# Altium schematic sheet [06]-xxx.SchDoc: XXX
size A3; Organization: Toradex AG; Address1: Altsagenstrasse 5; Address2: Horw; Address3: 6048; Address4: Switzerland; DocumentNumber: 6; Revision: V3.2; SheetNumber: 6; SheetTotal: 14; PageSetup: Record=PageOptions|CenterHorizontal=True|CenterVertical=True|PrintScale=0.73|XCorrection=1.00|YCorrection=1.00|PrintKind=0|BorderSize=5000000|LeftOffset=0|BottomOffset=0|Orientation=2|PaperLength=1000|PaperWidth=1000|Scale=100|PaperSource=7|PrintQuality=600|MediaType=1|DitherType=10|PaperKind=A4|PrintScaleMode=1
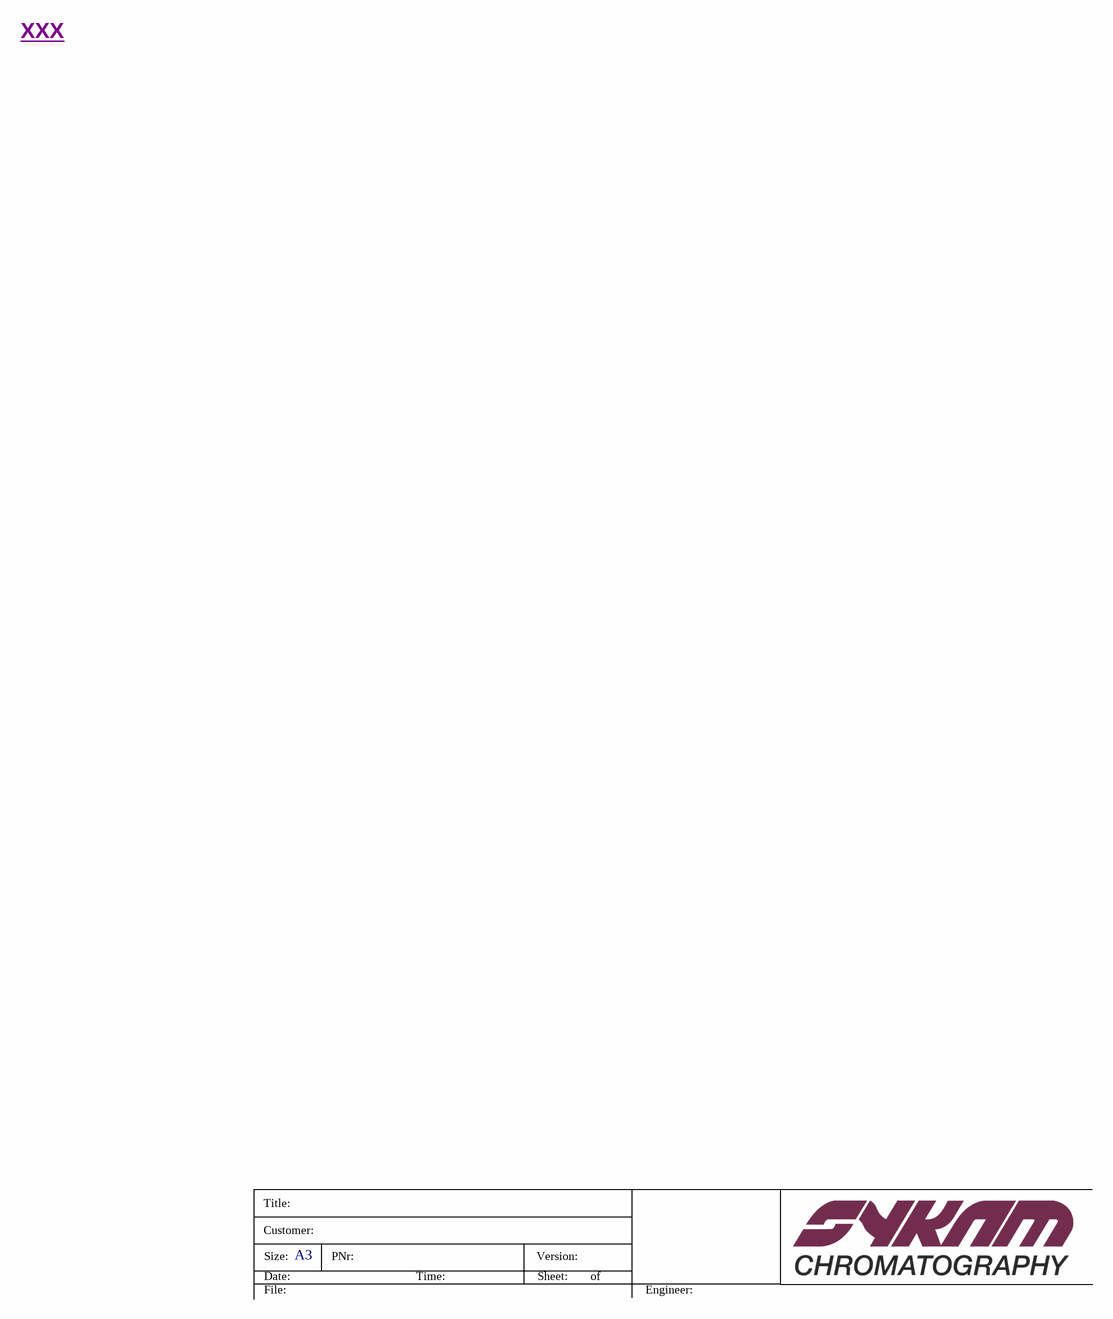
[diagram p0: [06]-xxx.SchDoc]

## Notes on the sheet
- XXX
- Title:
- Customer:
- Size:
- Date:
- A3
- PNr:
- Time:
- Version:
- Sheet:
- of
- File:
- Engineer:
- Title
- Number:
- Revision:
- Sheet